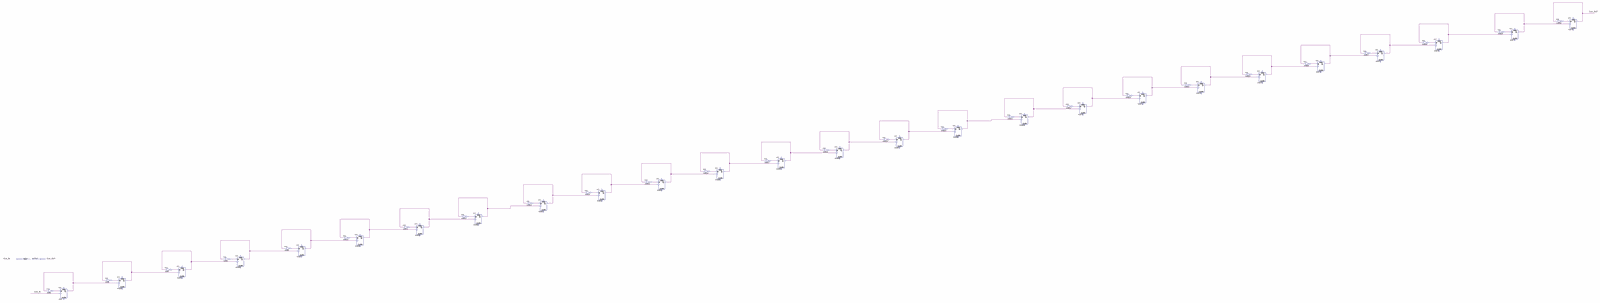
[diagram p0: schematic sheet, whole]
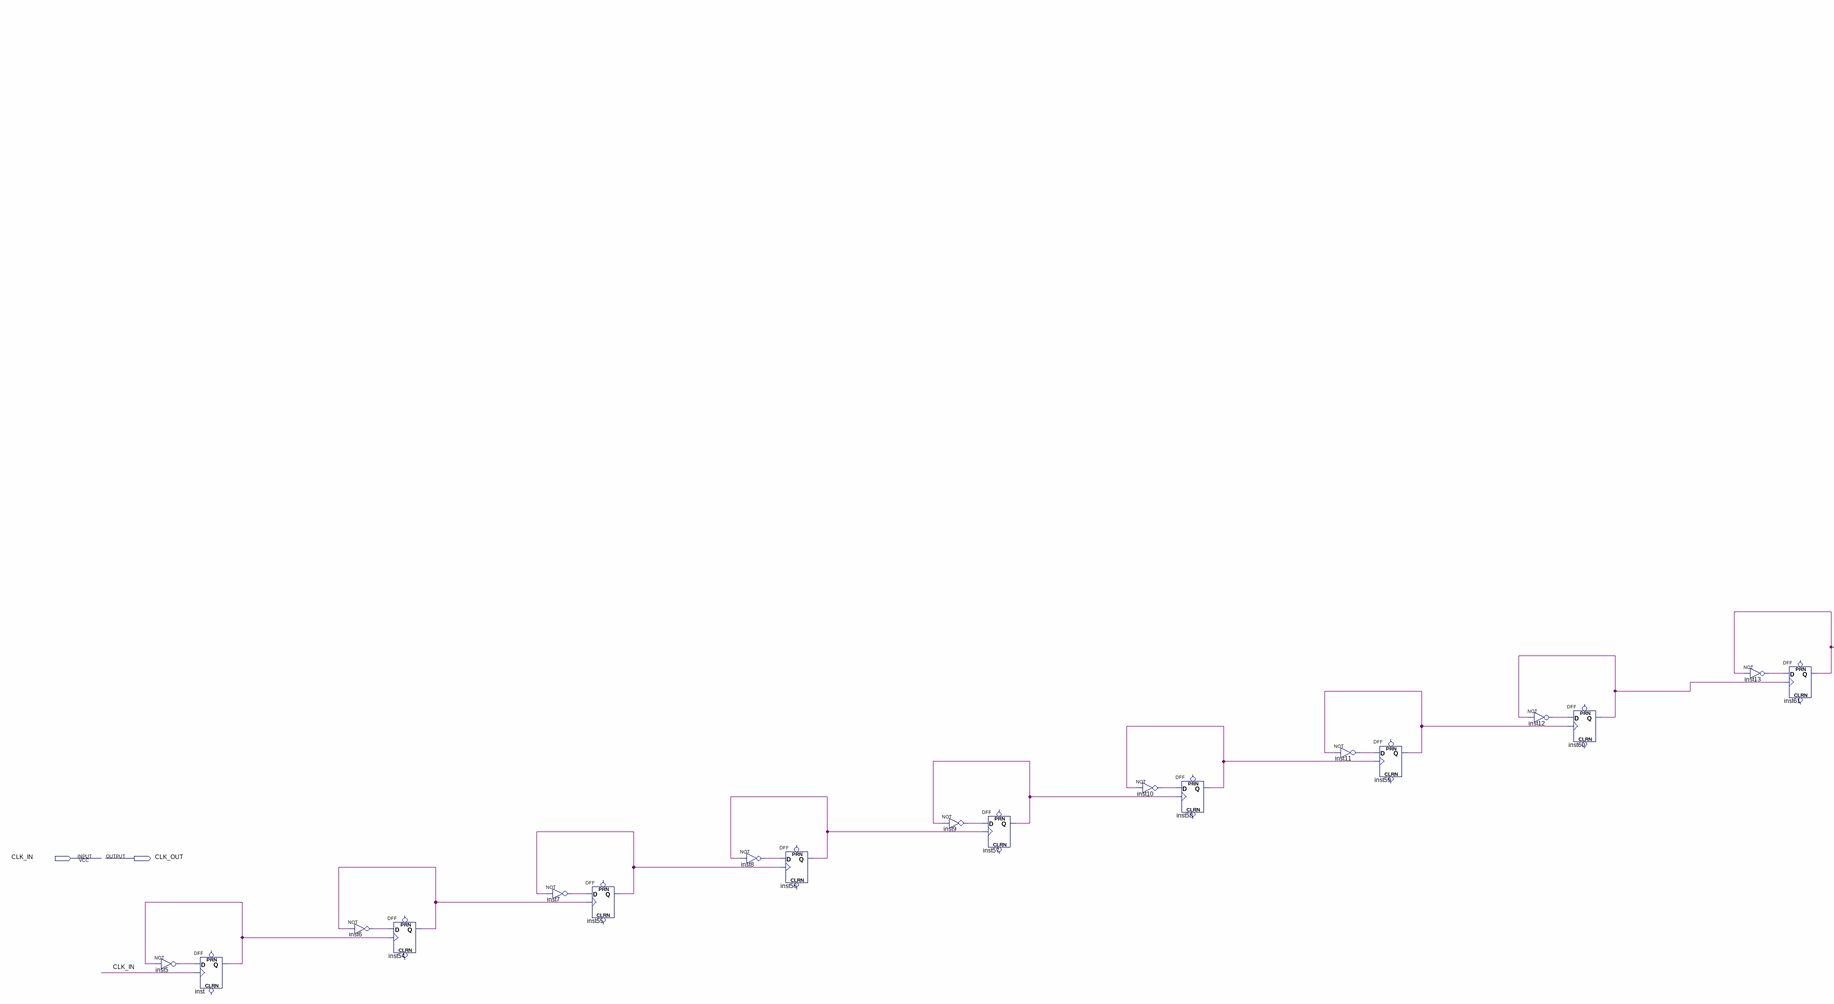
[diagram p1: schematic sheet, left part]
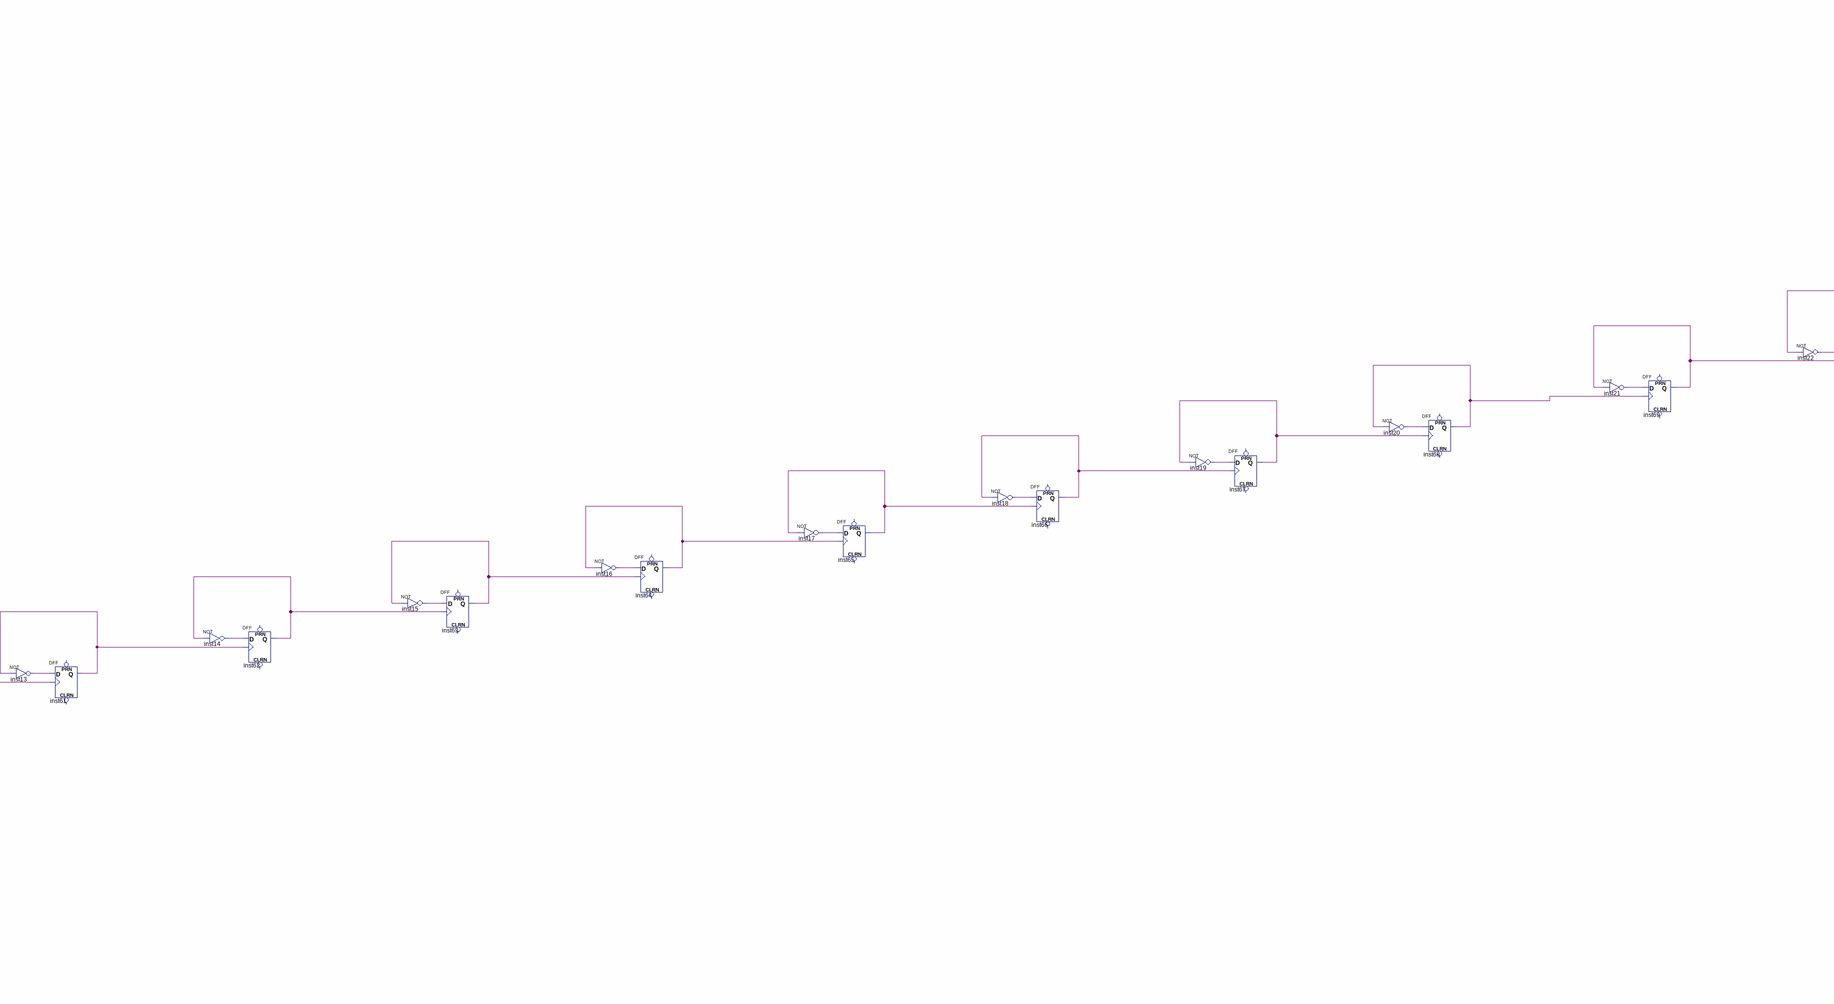
[diagram p2: schematic sheet, centre part]
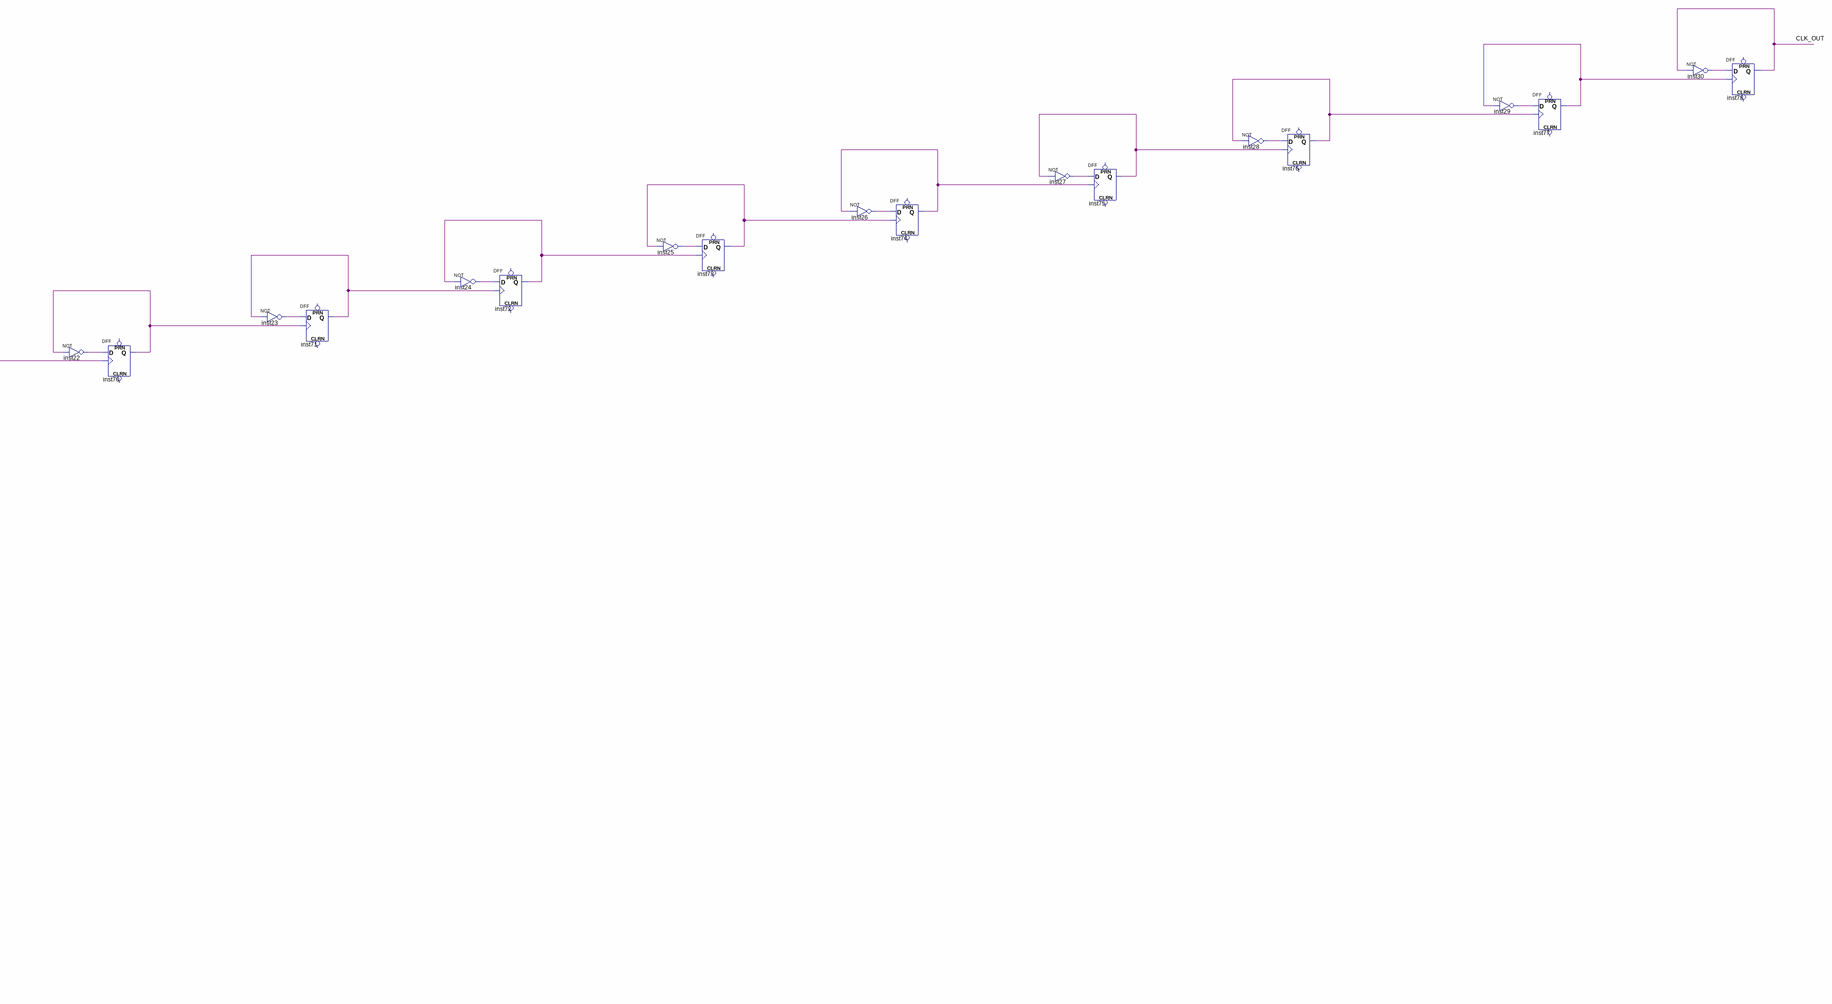
[diagram p3: schematic sheet, right part]
// Quartus schematic DIVFREQ.bdf as structural Verilog: 52 symbols, 2 pins
module DIVFREQ (
  input  CLK_IN,
  output CLK_OUT
);

  wire inst5_out, inst6_out, inst7_out, inst8_out, inst9_out, inst10_out, inst11_out, inst12_out, inst13_out,
       inst14_out, inst15_out, inst16_out, inst17_out, inst18_out, inst19_out, inst20_out, inst21_out,
       inst22_out, inst23_out, inst24_out, inst25_out, inst26_out, inst27_out, inst28_out, inst29_out,
       inst30_out, inst54_q, inst55_q, inst56_q, inst57_q, inst58_q, inst59_q, inst60_q, inst61_q, inst62_q,
       inst63_q, inst64_q, inst65_q, inst66_q, inst67_q, inst68_q, inst69_q, inst70_q, inst71_q, inst72_q,
       inst73_q, inst74_q, inst75_q, inst76_q, inst77_q, inst_q;

  not inst5 (inst5_out, inst_q);
  DFF inst (.CLK(CLK_IN), .D(inst5_out), .Q(inst_q));  // open: CLRN, PRN
  not inst6 (inst6_out, inst54_q);
  DFF inst54 (.CLK(inst_q), .D(inst6_out), .Q(inst54_q));  // open: CLRN, PRN
  not inst7 (inst7_out, inst55_q);
  DFF inst55 (.CLK(inst54_q), .D(inst7_out), .Q(inst55_q));  // open: CLRN, PRN
  not inst8 (inst8_out, inst56_q);
  DFF inst56 (.CLK(inst55_q), .D(inst8_out), .Q(inst56_q));  // open: CLRN, PRN
  not inst9 (inst9_out, inst57_q);
  DFF inst57 (.CLK(inst56_q), .D(inst9_out), .Q(inst57_q));  // open: CLRN, PRN
  not inst10 (inst10_out, inst58_q);
  DFF inst58 (.CLK(inst57_q), .D(inst10_out), .Q(inst58_q));  // open: CLRN, PRN
  not inst11 (inst11_out, inst59_q);
  DFF inst59 (.CLK(inst58_q), .D(inst11_out), .Q(inst59_q));  // open: CLRN, PRN
  not inst12 (inst12_out, inst60_q);
  DFF inst60 (.CLK(inst59_q), .D(inst12_out), .Q(inst60_q));  // open: CLRN, PRN
  not inst13 (inst13_out, inst61_q);
  DFF inst61 (.CLK(inst60_q), .D(inst13_out), .Q(inst61_q));  // open: CLRN, PRN
  not inst14 (inst14_out, inst62_q);
  DFF inst62 (.CLK(inst61_q), .D(inst14_out), .Q(inst62_q));  // open: CLRN, PRN
  not inst15 (inst15_out, inst63_q);
  DFF inst63 (.CLK(inst62_q), .D(inst15_out), .Q(inst63_q));  // open: CLRN, PRN
  not inst16 (inst16_out, inst64_q);
  DFF inst64 (.CLK(inst63_q), .D(inst16_out), .Q(inst64_q));  // open: CLRN, PRN
  not inst17 (inst17_out, inst65_q);
  DFF inst65 (.CLK(inst64_q), .D(inst17_out), .Q(inst65_q));  // open: CLRN, PRN
  not inst18 (inst18_out, inst66_q);
  DFF inst66 (.CLK(inst65_q), .D(inst18_out), .Q(inst66_q));  // open: CLRN, PRN
  not inst19 (inst19_out, inst67_q);
  DFF inst67 (.CLK(inst66_q), .D(inst19_out), .Q(inst67_q));  // open: CLRN, PRN
  not inst20 (inst20_out, inst68_q);
  DFF inst68 (.CLK(inst67_q), .D(inst20_out), .Q(inst68_q));  // open: CLRN, PRN
  not inst21 (inst21_out, inst69_q);
  DFF inst69 (.CLK(inst68_q), .D(inst21_out), .Q(inst69_q));  // open: CLRN, PRN
  not inst22 (inst22_out, inst70_q);
  DFF inst70 (.CLK(inst69_q), .D(inst22_out), .Q(inst70_q));  // open: CLRN, PRN
  not inst23 (inst23_out, inst71_q);
  DFF inst71 (.CLK(inst70_q), .D(inst23_out), .Q(inst71_q));  // open: CLRN, PRN
  not inst24 (inst24_out, inst72_q);
  DFF inst72 (.CLK(inst71_q), .D(inst24_out), .Q(inst72_q));  // open: CLRN, PRN
  not inst25 (inst25_out, inst73_q);
  DFF inst73 (.CLK(inst72_q), .D(inst25_out), .Q(inst73_q));  // open: CLRN, PRN
  not inst26 (inst26_out, inst74_q);
  DFF inst74 (.CLK(inst73_q), .D(inst26_out), .Q(inst74_q));  // open: CLRN, PRN
  not inst27 (inst27_out, inst75_q);
  DFF inst75 (.CLK(inst74_q), .D(inst27_out), .Q(inst75_q));  // open: CLRN, PRN
  not inst28 (inst28_out, inst76_q);
  DFF inst76 (.CLK(inst75_q), .D(inst28_out), .Q(inst76_q));  // open: CLRN, PRN
  not inst29 (inst29_out, inst77_q);
  DFF inst77 (.CLK(inst76_q), .D(inst29_out), .Q(inst77_q));  // open: CLRN, PRN
  not inst30 (inst30_out, CLK_OUT);
  DFF inst78 (.CLK(inst77_q), .D(inst30_out), .Q(CLK_OUT));  // open: CLRN, PRN
endmodule
